# EAGLE schematic Esquema_Eletrico_Fusion (EAGLE 9.7.0)
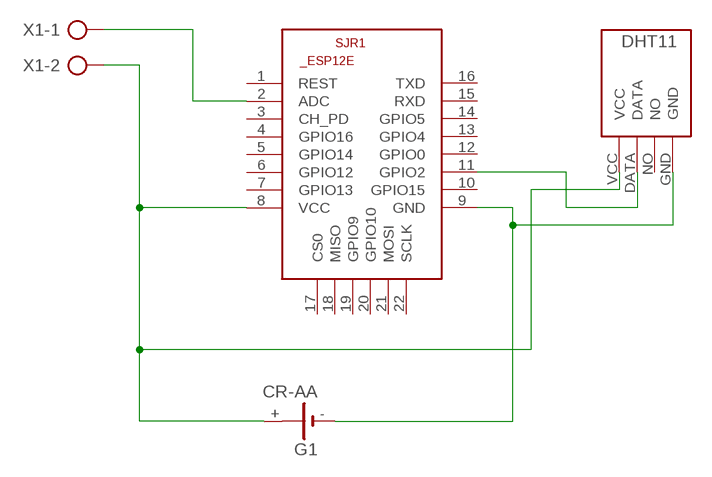
[diagram p0: schematic, sheet 1]

## Parts
G1  CR-AA  [CRAA]
SJR1  ESP8266-12EESP12E  [ESP8266-ESP12E]
U$1  DHT11-PION.  [DHT11-PION.]
X1  AK300/2  [AK300/2]

## Nets
N$1: SJR1.2(ADC) X1.1
N$2: G1.+ SJR1.8(VCC) U$1.VCC X1.2
N$3: SJR1.11(GPIO2) U$1.DATA
N$4: G1.- SJR1.9(GND) U$1.GND
Unconnected: G1.+@1(+) SJR1.1(REST) SJR1.3(CH_PD) SJR1.4(GPIO16) SJR1.5(GPIO14) SJR1.6(GPIO12) SJR1.7(GPIO13) SJR1.10(GPIO15) SJR1.12(GPIO0) SJR1.13(GPIO4) SJR1.14(GPIO5) SJR1.15(RXD) SJR1.16(TXD) SJR1.17(CS0) SJR1.18(MISO) SJR1.19(GPIO9) SJR1.20(GPIO10) SJR1.21(MOSI) SJR1.22(SCLK) U$1.NO

## Library data of the parts
G1 = battery:CR-AA: LI BATTERY Varta CRAA-SLF
SJR1 = esp12e:ESP8266-12E: ESP8266-12E Library for Eagle CAD The author not responsible for any damages or errors!. Created by Suhail jr.lt;/author>
U$1 = DHT11:DHT11-PION.: DHT11 Czujnik temperatury i wilgotności (widok pionowy)
X1 = con-ptr500:AK300/2: CONNECTOR; OC_FARNELL: unknown; OC_NEWARK: unknown